# EAGLE design geiger_dice (EAGLE 9.6.2)
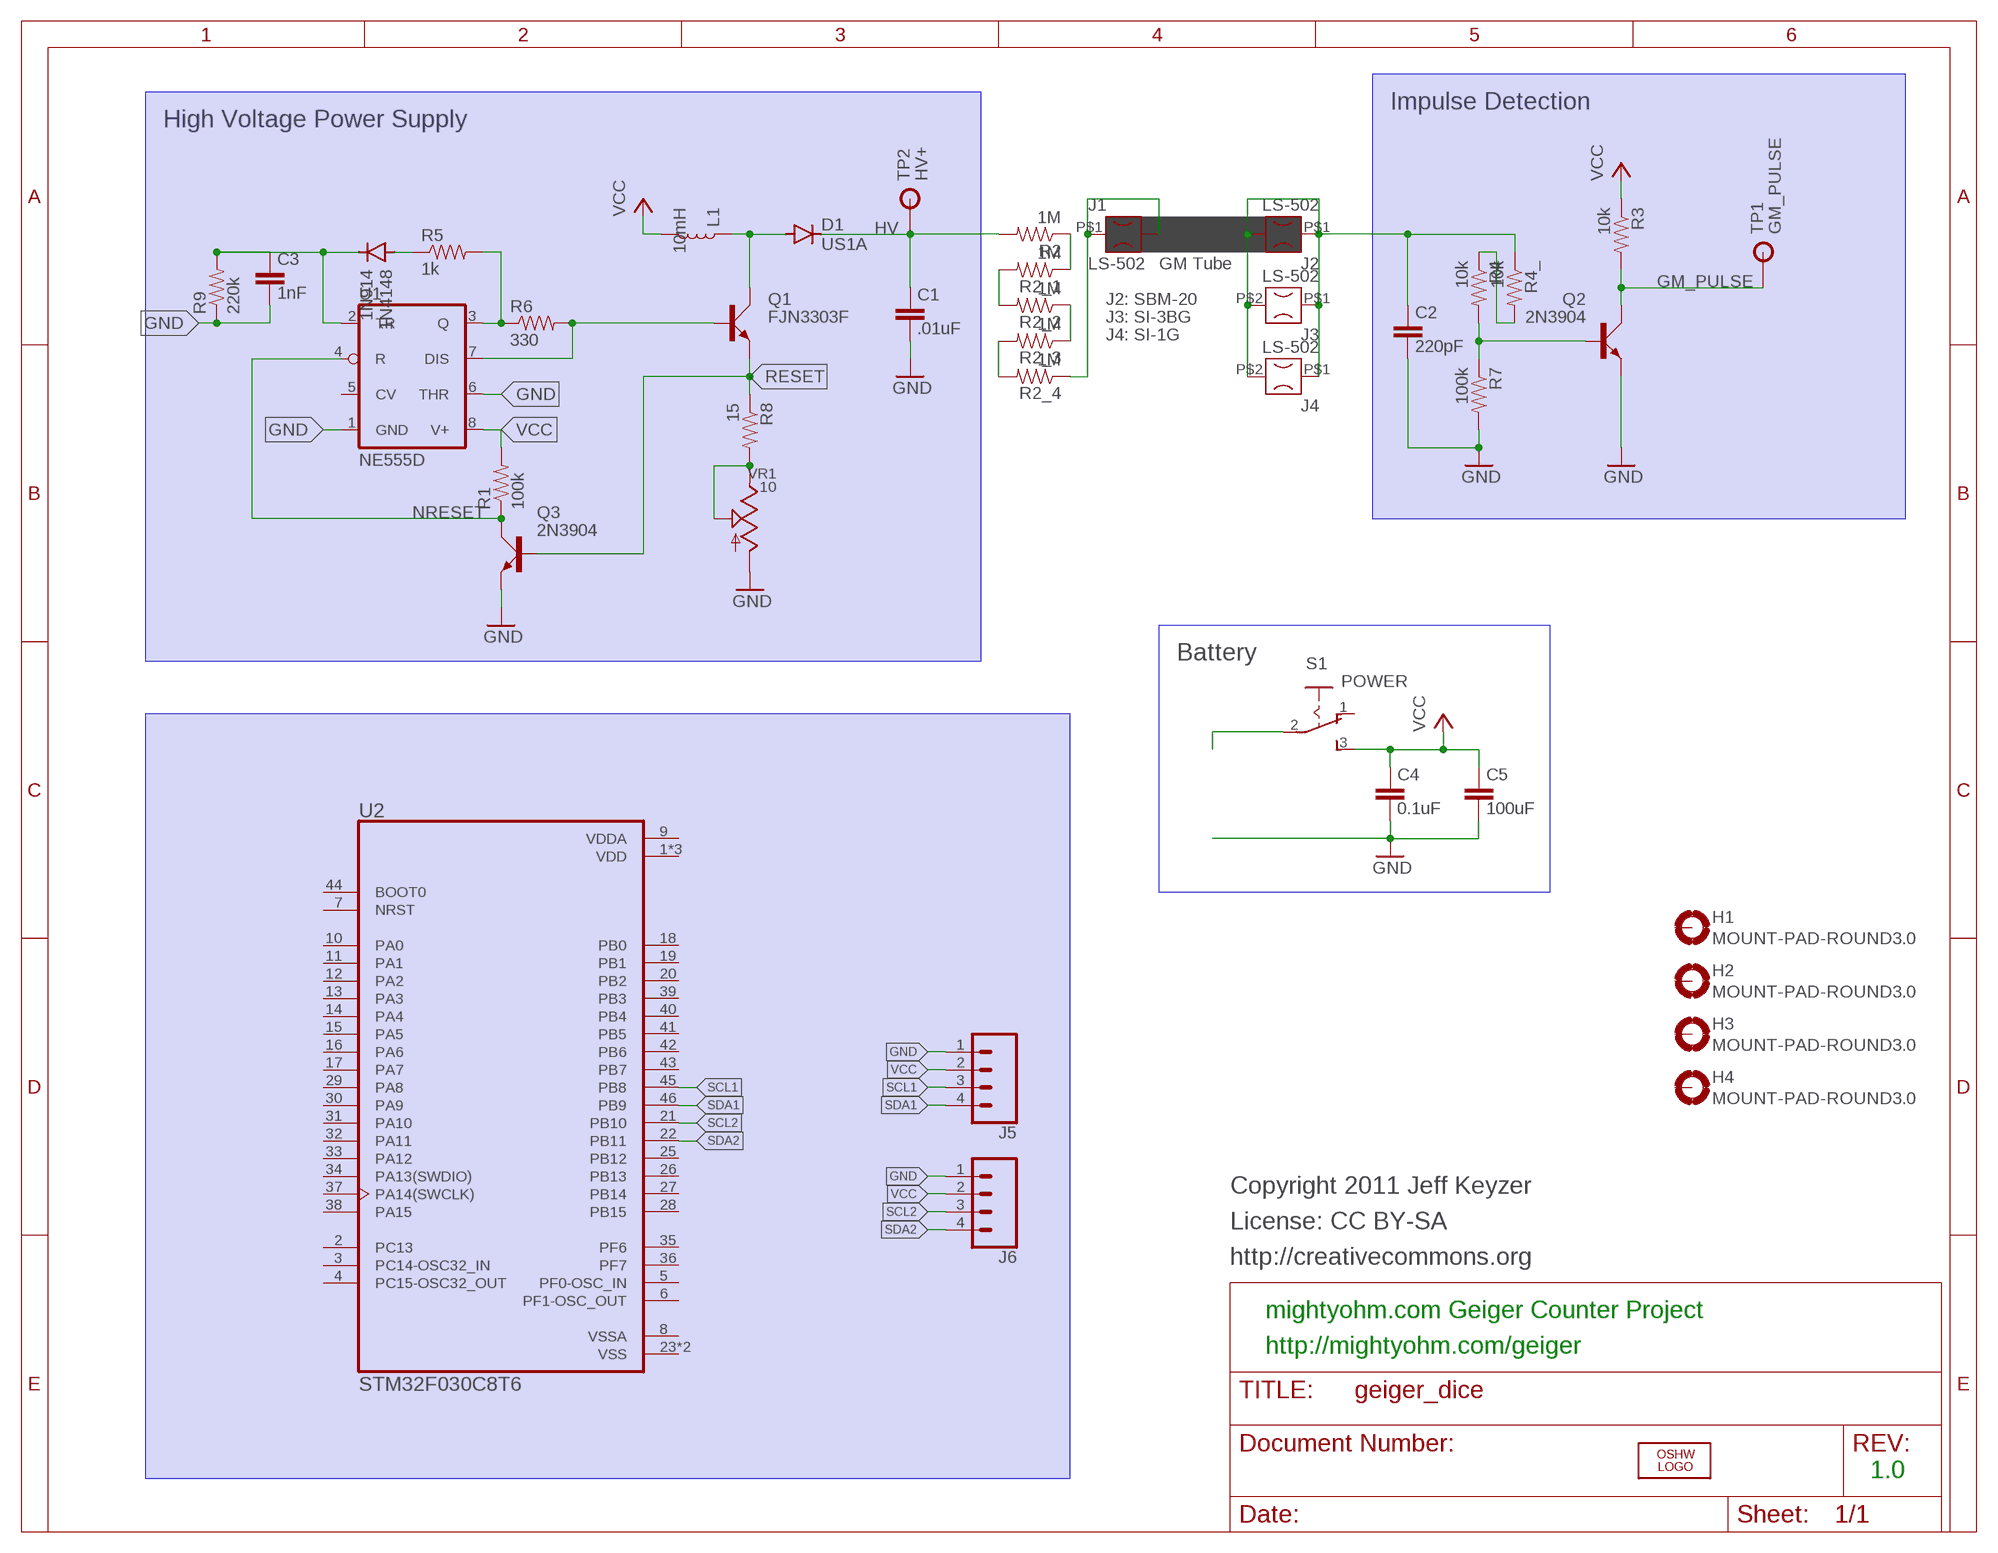
[diagram p0: schematic, sheet 1]

## Parts
1N4148  1N914  DIODE-SOD123  [SOD123]
C1  .01uF  CC0805KRX7R9BB104  [CAP_0805]
C2  220pF  GRM31CR60J107ME39L  [CAP_1206]
C3  1nF  CC0805KRX7R9BB104  [CAP_0805]
C4  0.1uF  CC0805KRX7R9BB104  [CAP_0805]
C5  100uF  GRM31CR60J107ME39L  [CAP_1206]
D1  US1A  DIODE-DO214AC  [DO214AC]
H1  MOUNT-PAD-ROUND3.0  [3,0-PAD]
H2  MOUNT-PAD-ROUND3.0  [3,0-PAD]
H3  MOUNT-PAD-ROUND3.0  [3,0-PAD]
H4  MOUNT-PAD-ROUND3.0  [3,0-PAD]
J1  LS-502  [LS-502]
J2  LS-502  [LS-502]
J3  LS-502  [LS-502]
J4  LS-502  [LS-502]
J5  CONN_04  [1X04]
J6  CONN_04  [1X04]
L1  10mH  INDUCTOR  [VLU0608]
LOGO1  OSHW_LOGO_FILLX0200-NT  [OSHW_FILLX200_NOTEXT]
Q1  FJN3303F  2N3704  [TO92C]
Q2  2N3904  [TO92D]
Q3  2N3904  [TO92D]
R1  100k  RESISTOR0805  [0805]
R2  1M  RESISTOR1206  [1206]
R2_1  1M  RESISTOR1206  [1206]
R2_2  1M  RESISTOR1206  [1206]
R2_3  1M  RESISTOR1206  [1206]
R2_4  1M  RESISTOR1206  [1206]
R3  10k  RESISTOR0805  [0805]
R4  10k  RESISTOR1206  [1206]
R4_  10k  RESISTOR1206  [1206]
R5  1k  RESISTOR0805  [0805]
R6  330  RESISTOR0805  [0805]
R7  100k  RESISTOR1206  [1206]
R8  15  RESISTOR0805  [0805]
R9  220k  RESISTOR0805  [0805]
S1  POWER  SWITCH_SPDT  [OS102011]
TP1  GM_PULSE  TPPTH  [TP_PTH]
TP2  HV+  TPPTH  [TP_PTH]
U1  NE555D  [SO08]
U2  STM32F030C8T6  [QFP50P900X900X160-48N]
VR1  10  3314J-1-100E  [3314J-1]

## Nets
GM_PULSE: Q2.C R3.2 TP1.P$1(TP)
GND: C1.2 C2.2 C3.2 C4.2 C5.2 J5.1 J6.1 Q2.E Q3.E R7.2 R9.1 U1.1(GND) U1.6(THR) VR1.3
HV: C1.1 D1.C R2.2 TP2.P$1(TP)
N$1: 1N4148.A R5.1
N$3: R4.1 R4_.2
N$5: S1.2
N$8: Q1.B R6.2 U1.7(DIS)
N$9: 1N4148.C C3.1 R9.2 U1.2(TR)
N$10: R5.2 R6.1 U1.3(Q)
N$11: R2_3.2 R2_4.2
N$12: D1.A L1.P$1 Q1.C
N$14: Q2.B R4.2 R7.1
N$15: J1.P$1 J1.P$2 R2_4.1
N$23: R8.2 VR1.1 VR1.2
N$24: R2.1 R2_1.1
N$25: R2_1.2 R2_2.2
N$26: R2_2.1 R2_3.1
N$39: C2.1 J2.P$1 J2.P$2 J3.P$1 J3.P$2 J4.P$1 J4.P$2 R4_.1
NRESET: Q3.C R1.1 U1.4(R)
RESET: Q1.E Q3.B R8.1
SCL1: J5.3 U2.45(PB8)
SCL2: J6.3 U2.21(PB10)
SDA1: J5.4 U2.46(PB9)
SDA2: J6.4 U2.22(PB11)
VCC: C4.1 C5.1 J5.2 J6.2 L1.P$2 R1.2 R3.1 S1.3 U1.8(V+)
Unconnected: H1.B3,0(MOUNT) H2.B3,0(MOUNT) H3.B3,0(MOUNT) H4.B3,0(MOUNT) S1.1 U1.5(CV) U2.2(PC13) U2.3(PC14-OSC32_IN) U2.4(PC15-OSC32_OUT) U2.5(PF0-OSC_IN) U2.6(PF1-OSC_OUT) U2.7(NRST) U2.10(PA0) U2.11(PA1) U2.12(PA2) U2.13(PA3) U2.14(PA4) U2.15(PA5) U2.16(PA6) U2.17(PA7) U2.18(PB0) U2.19(PB1) U2.20(PB2) U2.25(PB12) U2.26(PB13) U2.27(PB14) U2.28(PB15) U2.29(PA8) U2.30(PA9) U2.31(PA10) U2.32(PA11) U2.33(PA12) U2.34(PA13(SWDIO)) U2.35(PF6) U2.36(PF7) U2.37(PA14(SWCLK)) U2.38(PA15) U2.39(PB3) U2.40(PB4) U2.41(PB5) U2.42(PB6) U2.43(PB7) U2.44(BOOT0)

## Notes on the sheet
- Impulse Detection
- High Voltage Power Supply
- GM Tube
- J2: SBM-20
- J3: SI-3BG
- J4: SI-1G
- Battery
- Copyright 2011 Jeff Keyzer
- License: CC BY-SA
- http://creativecommons.org
- mightyohm.com Geiger Counter Project
- http://mightyohm.com/geiger
- 1.0

## Power pins joined to a net without a drawn wire
VDD: U2.1(VDD) U2.24(VDD) U2.48(VDD)
VDDA: U2.9(VDDA)
VSS: U2.23(VSS) U2.47(VSS)
VSSA: U2.8(VSSA)

## Library data of the parts
1N4148 D1 = diode:DIODE-: DIODE
C1 C3 C4 = Resistor_Capacitor:CC0805KRX7R9BB104: CAP CER 0.1UF 50V X7R 0805 Manufacturer's datasheet <http://www.yageo.com/documents/recent/UPY-GPHC_X7R_6.3V-to-50V_18.pdf>; CREATED_BY: PCBLayout.com; DIGIKEY_PART_NUMBER: 311-1140-2-ND; MANUFACTURER: Yageo; MPN: CC0805KRX7R9BB104; PACKAGE: SMD 0805
C2 C5 = Resistor_Capacitor:GRM31CR60J107ME39L: CAP CER 100UF 6.3V X5R 1206 Manufacturer's datasheet <https://www.murata.com/~/media/webrenewal/support/library/catalog/products/capacitor/mlcc/c02e.ashx?la=en-us>; CREATED_BY: PCBLayout.com; DIGIKEY_PART_NUMBER: GRM31CR60J107ME39L; MANUFACTURER: Murata Electronics North America; MPN: GRM31CR60J107ME39L; PACKAGE: SMD 1206
H1-H4 = holes:MOUNT-PAD-ROUND: MOUNTING PAD, round
J1-J4 = custom:LS-502
J5 J6 = SparkFun-Connectors:CONN_04: Multi connection point. Often used as Generic Header-pin footprint for 0.1 inch spaced/style header connections On any of the 0.1 inch spaced packages, you can populate with these: Break Away Headers - Straight <https://www.sparkfun.com/products/116> (PRT-00116) Break Away Male Headers - Right Angle <https://www.sparkfun.com/products/553> (PRT-00553) Female Headers <https://www.sparkfun.com/products/115> (PRT-00115) Break Away Headers - Machine Pin <https://www.sparkfun.com/products/117> (PRT-00117) Break Away Female Headers - Swiss Machine Pin <https://www.sparkfun.com/products/743> (PRT-00743) For SCREWTERMINALS and SPRING TERMINALS visit here: Screw Terimnals on SparkFun.com <https://www.sparkfun.com/search/results?term=Screw+Terminals> (5mm/3.5mm/2.54mm spacing) This device is also useful as a general connection point to wire up your design to another part of your project. Our various solder wires solder well into these plated through hole pads. Hook-Up Wire - Assortment (Stranded, 22 AWG) <https://www.sparkfun.com/products/11375> (PRT-11375) Hook-Up Wire - Assortment (Solid Core, 22 AWG) <https://www.sparkfun.com/products/11367> (PRT-11367) View the entire wire category on our website here <https://www.sparkfun.com/categories/141> Special notes: Molex polarized connector foot print use with SKU : PRT-08231 with associated crimp pins and housings. 1MM SMD Version SKU: PRT-10208; PROD_ID: CONN-09696
L1 = custom:INDUCTOR: Inductors Resist changes in electrical current. Basically a coil of wire. SparkFun Products: SparkFun Load Cell Amplifier - HX711 <https://www.sparkfun.com/products/13879> IOIO-OTG - V2.2 <https://www.sparkfun.com/products/13613>
LOGO1 = OSHW:OSHW_LOGO_FILL
Q1 = transistor-small-signal:2N3704: NPN TRANSISTOR
Q2 Q3 = transistor-small-signal:2N3904: NPN TRANSISTOR
R1 R2 R2_1-R2_4 R3 R4 R4_ R5-R9 = custom:RESISTOR: Generic Resistor Package
S1 = passives:SWITCH_SPDT
TP1 TP2 = connectors:TP: Test Point JSK 1/14/11
U1 = custom:*555: TIMER
U2 = STM32F030C8T6:STM32F030C8T6: STM32F Series 32-bit 64 kB Flash 8 kB RAM ARM Based Microcontroller - LQFP-48 Check availability <https://pricing.snapeda.com/parts/STM32F030C8T6/STMicroelectronics/view-part?ref=eda>; AVAILABILITY: In Stock; DESCRIPTION: ARM® Cortex®-M0 series Microcontroller IC 32-Bit Single-Core 48MHz 64KB (64K x 8) FLASH 48-LQFP (7x7); MF: STMicroelectronics; MP: STM32F030C8T6; PACKAGE: LQFP-48 STMicroelectronics; PRICE: None; PURCHASE-URL: https://pricing.snapeda.com/search/part/STM32F030C8T6/?ref=eda
VR1 = custom:3314J-1-100E

## Board
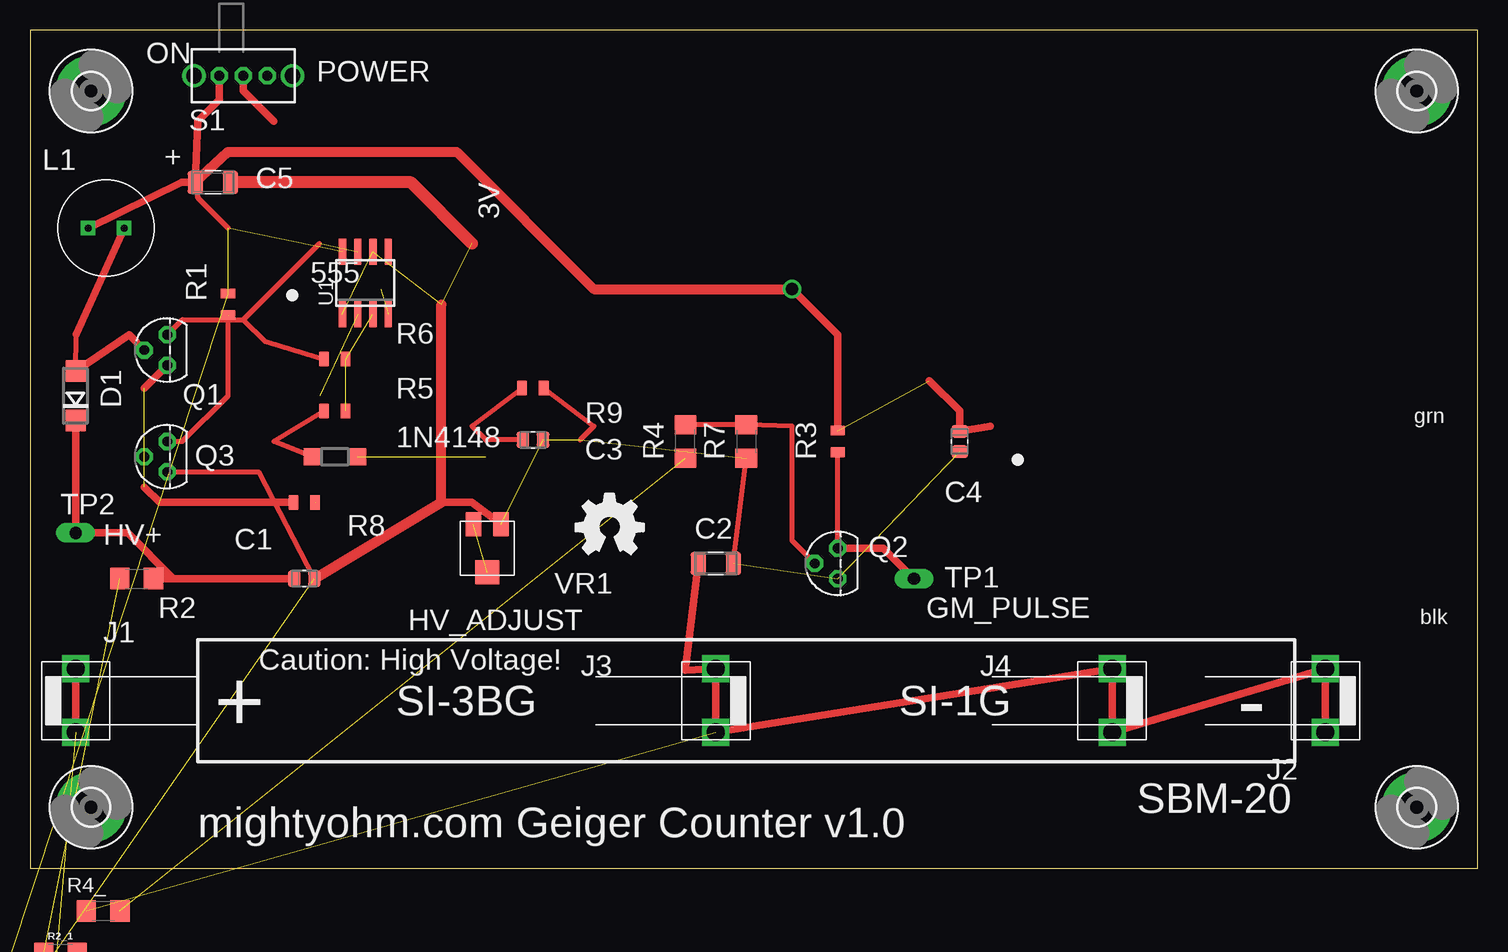
[diagram p1: board, top side]
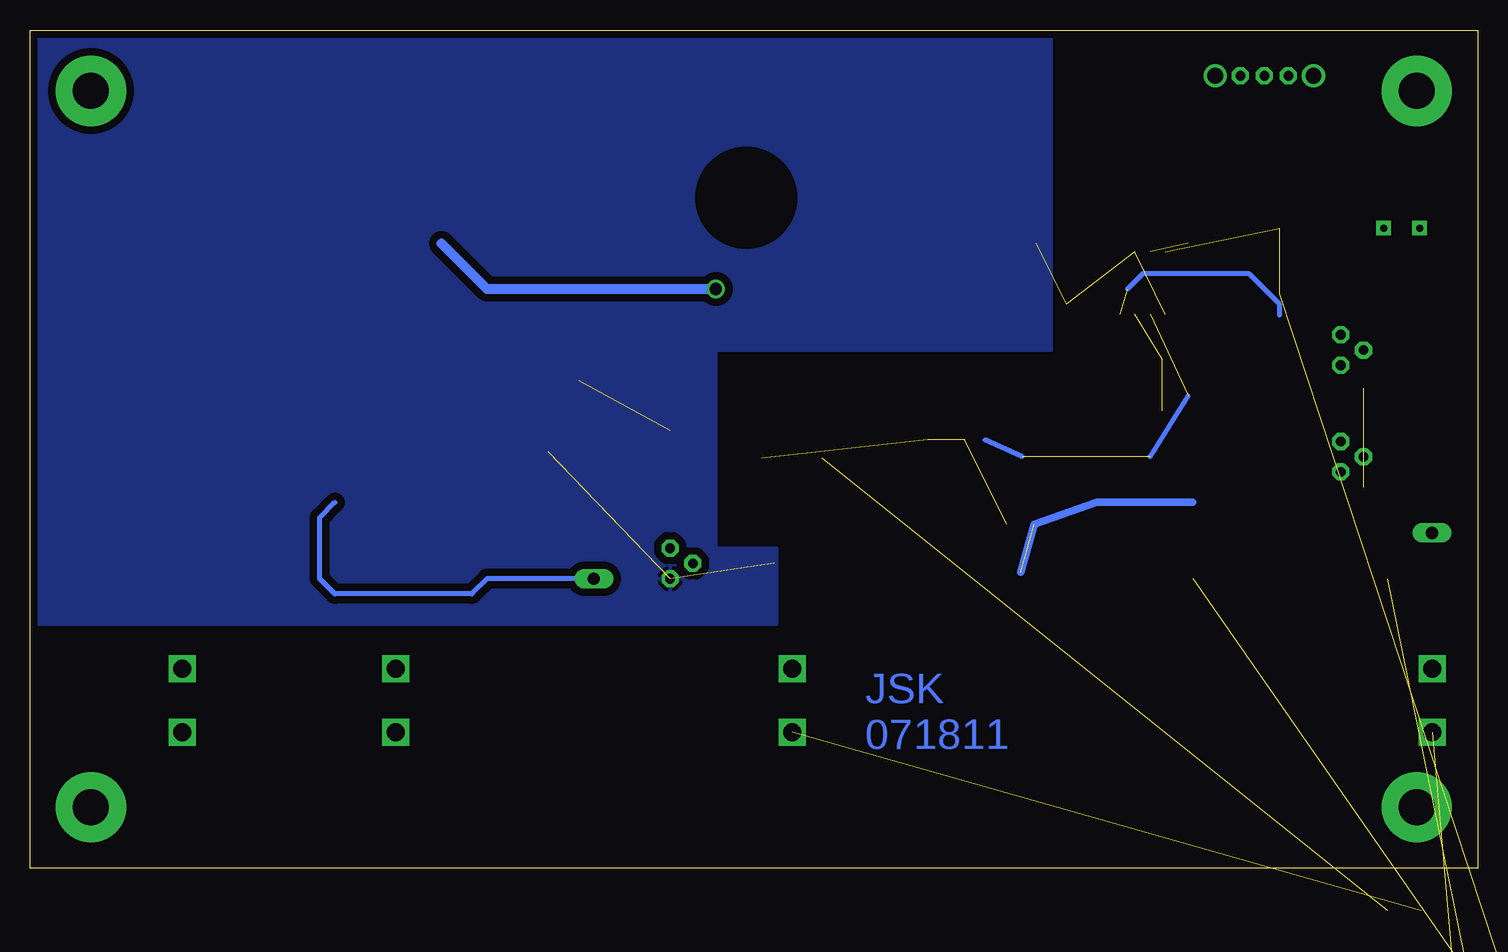
[diagram p2: board, bottom side, seen from below]

Size 120.65 x 69.85 mm. Coordinates in mm from the lower left corner, seen from the top.
Outline: 0,0 120.63,0 120.65,69.85 0,69.85 0,0
Copper layers (1*16): Top 0.035mm / dielectric 1.5mm / Bottom 0.0356mm
Design rules "generic_2l": minimum track width 8mil, minimum drill 20mil, track to track 8mil, track to pad 8mil, pad to pad 8mil, via to via 8mil, smd to smd 0mil, copper to edge 15mil, drill to drill 10mil, minimum pad ring 12mil, minimum via ring 8mil, stop-mask expansion 4mil, vias tented up to drill 25mil, thermal gap 12mil
bRestrict: area 57.4,52.3 to 64.6,59.5

### Footprints (pad centres in the part's own frame; a part is rotated, then mirrored left to right if it is on the bottom)
SOD123 = smd 1.4 x 1.4: A 1.9,0; C -1.9,0
CAP_0805 = smd 1.05 x 1.38: 1 -0.84,0; 2 0.84,0
CAP_1206 = smd 1.29 x 1.91: 1 -1.46,0; 2 1.46,0
DO214AC = smd 1.8 x 1.7: A 2.05,0; C -2.05,0
3,0-PAD = drill 3 pad 5.842: B3,0 0,0
LS-502 = drill 1.5 square: P$1 0,-2.65; P$2 0,2.65
1X04 = drill 1.016 pad 1.88: 1 0,0; 2 2.54,0; 3 5.08,0; 4 7.62,0
VLU0608 = drill 0.6 square: P$1 1.5,0; P$2 -1.5,0
TO92C = drill 0.813 octagon: B 1.27,0; C 0,1.905; E -1.27,0
TO92D = drill 0.813 octagon: B 0,1.905; C 1.27,0; E -1.27,0
0805 = smd 0.8 x 1.2: 1 -0.9,0; 2 0.9,0
1206 = smd 1.6 x 1.8: 1 -1.4,0; 2 1.4,0
OS102011 = drill 0.813 octagon: 1 -2,0; 2 0,0; 3 2,0 | drill 1.3: P$1 -4.1,0; P$2 4.1,0
TP_PTH = drill 1.016 long: P$1 0,0
SO08 = smd 0.6 x 2.2: 1 -1.905,-2.6; 2 -0.635,-2.6; 3 0.635,-2.6; 4 1.905,-2.6; 5 1.905,2.6; 6 0.635,2.6; 7 -0.635,2.6; 8 -1.905,2.6
QFP50P900X900X160-48N = smd 1.56 x 0.28: 1 -4.18,2.75; 2 -4.18,2.25; 3 -4.18,1.75; 4 -4.18,1.25; 5 -4.18,0.75; 6 -4.18,0.25; 7 -4.18,-0.25; 8 -4.18,-0.75; 9 -4.18,-1.25; 10 -4.18,-1.75; 11 -4.18,-2.25; 12 -4.18,-2.75; 25 4.18,-2.75; 26 4.18,-2.25; 27 4.18,-1.75; 28 4.18,-1.25; 29 4.18,-0.75; 30 4.18,-0.25; 31 4.18,0.25; 32 4.18,0.75; 33 4.18,1.25; 34 4.18,1.75; 35 4.18,2.25; 36 4.18,2.75 | smd 0.28 x 1.56: 13 -2.75,-4.18; 14 -2.25,-4.18; 15 -1.75,-4.18; 16 -1.25,-4.18; 17 -0.75,-4.18; 18 -0.25,-4.18; 19 0.25,-4.18; 20 0.75,-4.18; 21 1.25,-4.18; 22 1.75,-4.18; 23 2.25,-4.18; 24 2.75,-4.18; 37 2.75,4.18; 38 2.25,4.18; 39 1.75,4.18; 40 1.25,4.18; 41 0.75,4.18; 42 0.25,4.18; 43 -0.25,4.18; 44 -0.75,4.18; 45 -1.25,4.18; 46 -1.75,4.18; 47 -2.25,4.18; 48 -2.75,4.18
3314J-1 = smd 1.3 x 2: 1 -1.15,2; 3 1.15,2 | smd 2 x 2: 2 0,-2

### Placement (x,y rotation side)
1N4148  25.4,34.29 180 top
C1  22.86,24.13 0 top
C2  57.15,25.4 0 top
C3  41.91,35.69 0 top
C4  77.47,35.56 270 top
C5  15.24,57.15 0 top
D1  3.81,39.37 90 top
H1  115.57,5.08 0 top
H2  115.57,64.77 0 top
H3  5.08,5.08 0 top
H4  5.08,64.77 0 top
J1  3.81,13.97 0 top
J2  107.95,13.97 180 top
J3  57.15,13.97 180 top
J4  90.17,13.97 180 top
J5  -9.65,-23.88 0 top  (outside the outline)
J6  -9.65,-27.94 0 top  (outside the outline)
L1  6.35,53.34 0 top
LOGO1  45.47,26.16 0 top
Q1  11.43,43.18 90 top
Q2  67.31,25.4 90 top
Q3  11.43,34.29 90 top
R1  16.51,46.99 90 top
R2  8.89,24.13 0 top
R2_1  2.54,-7.11 0 top  (outside the outline)
R2_2  2.54,-11.18 0 top  (outside the outline)
R2_3  2.54,-15.24 0 top  (outside the outline)
R2_4  2.54,-19.3 0 top  (outside the outline)
R3  67.31,35.56 270 top
R4  54.61,35.56 90 top
R4_  6.1,-3.56 0 top  (outside the outline)
R5  25.4,38.1 0 top
R6  25.4,42.42 180 top
R7  59.69,35.56 270 top
R8  22.86,30.48 0 top
R9  41.91,40.01 180 top
S1  17.78,66.04 180 top
TP1  73.66,24.13 0 top
TP2  3.81,27.94 0 top
U1  27.94,48.77 0 top
U2  -5.59,-13.72 0 top  (outside the outline)
VR1  38.1,26.67 0 top

### Tracks (layer width: path | path; a pad name or v marks a point on that pad's centre or on a via)
GM_PULSE
  Top 0.406: Q2.C R3.2
  Top 0.61: TP1.P$1 71.12,26.67 Q2.C
  Bottom 0.406: TP1.P$1 82.55,24.13 83.82,22.86 95.25,22.86 96.52,24.13 96.52,29.21 95.25,30.48
GND  (10 unrouted)
  Top 0.406: C2.2 R7.2 | Q3.E 19.05,33.02 C1.2 | 45.85,35.69 46.99,36.83 R9.1
  Top 0.61: 34.29,30.48 36.83,30.48 VR1.3
  Top 0.813: C1.2 34.29,30.48 34.29,46.99
  Top 1.016: C5.2 31.75,57.15 36.83,52.07
  pour Bottom (isolate 0.635): 120.65,69.85 35.56,69.85 35.56,43.18 63.5,43.18 63.5,26.67 58.42,26.67 58.42,20.32 120.65,20.32
HV
  Top 0.61: D1.C TP2.P$1 8.13,27.94 11.94,24.13 R2.2 C1.1
N$1
  Top 0.406: 1N4148.A 20.32,35.56 R5.1
N$3  (1 unrouted)
N$5
  Top 0.61: S1.2 17.78,64.77 20.32,62.23
N$8  (1 unrouted)
  Top 0.406: 17.78,45.72 19.59,43.91 R6.2 | 17.78,45.72 24.13,52.07 | Q1.B 12.7,45.72 17.78,45.72
N$9  (4 unrouted)
  Top 0.406: C3.1 37.97,35.69 36.83,36.83 R9.2
  Bottom 0.406: 37.97,34.29 C3.1 | 1N4148.C 24.13,39.37
N$10  (2 unrouted)
N$11  (1 unrouted)
N$12
  Top 0.406: D1.A 3.85,44.49
  Top 0.61: 3.85,44.49 L1.P$1 | D1.A 8.26,44.45 Q1.C
N$14
  Top 0.406: R4.2 R7.1 63.5,36.83 63.5,27.3 Q2.B
N$15  (1 unrouted)
  Top 0.61: J1.P$1 J1.P$2
N$23  (3 unrouted)
  Bottom 0.61: R8.2 31.75,30.48 VR1.1 VR1.2
N$24  (1 unrouted)
N$25  (1 unrouted)
N$26  (1 unrouted)
N$39  (1 unrouted)
  Top 0.61: J2.P$2 J2.P$1 J4.P$2 J4.P$1 J3.P$2 J3.P$1 54.61,16.51 C2.1
NRESET  (2 unrouted)
  Top 0.406: R1.1 16.51,39.37 12.7,35.56 Q3.C
  Bottom 0.406: 29.21,48.26 27.94,49.53 19.05,49.53 16.51,46.99 R1.1
RESET  (2 unrouted)
  Top 0.61: 9.53,40.01 Q1.E | R8.1 10.79,30.48 9.53,31.75
SCL1  (1 unrouted)
SCL2  (1 unrouted)
SDA1  (1 unrouted)
SDA2  (1 unrouted)
VCC  (via drill 1.02)  (5 unrouted)
  Top 0.406: 16.51,53.34 13.97,55.88 C5.1
  Top 0.61: 80.01,36.83 C4.1 77.47,38.1 74.93,40.64 | R3.1 67.31,44.45 v63.5,48.26 | S1.3 15.78,64.04 13.97,62.23 C5.1 12.66,57.15 L1.P$2
  Top 0.813: v63.5,48.26 46.99,48.26 35.56,59.69 16.51,59.69 C5.1
  Bottom 0.813: 86.36,52.07 82.55,48.26 v63.5,48.26
VDD  (2 unrouted)
VSS  (1 unrouted)

### Text on the board
Bottom: JSK | 071811
tPlace: ON | + | 3V | 555 | grn | HV_ADJUST | blk | Caution: High Voltage! | SI-3BG | SI-1G | + | - | SBM-20 | mightyohm.com Geiger Counter v1.0